# Altium schematic sheet Motors&Drivers.SchDoc
size A3
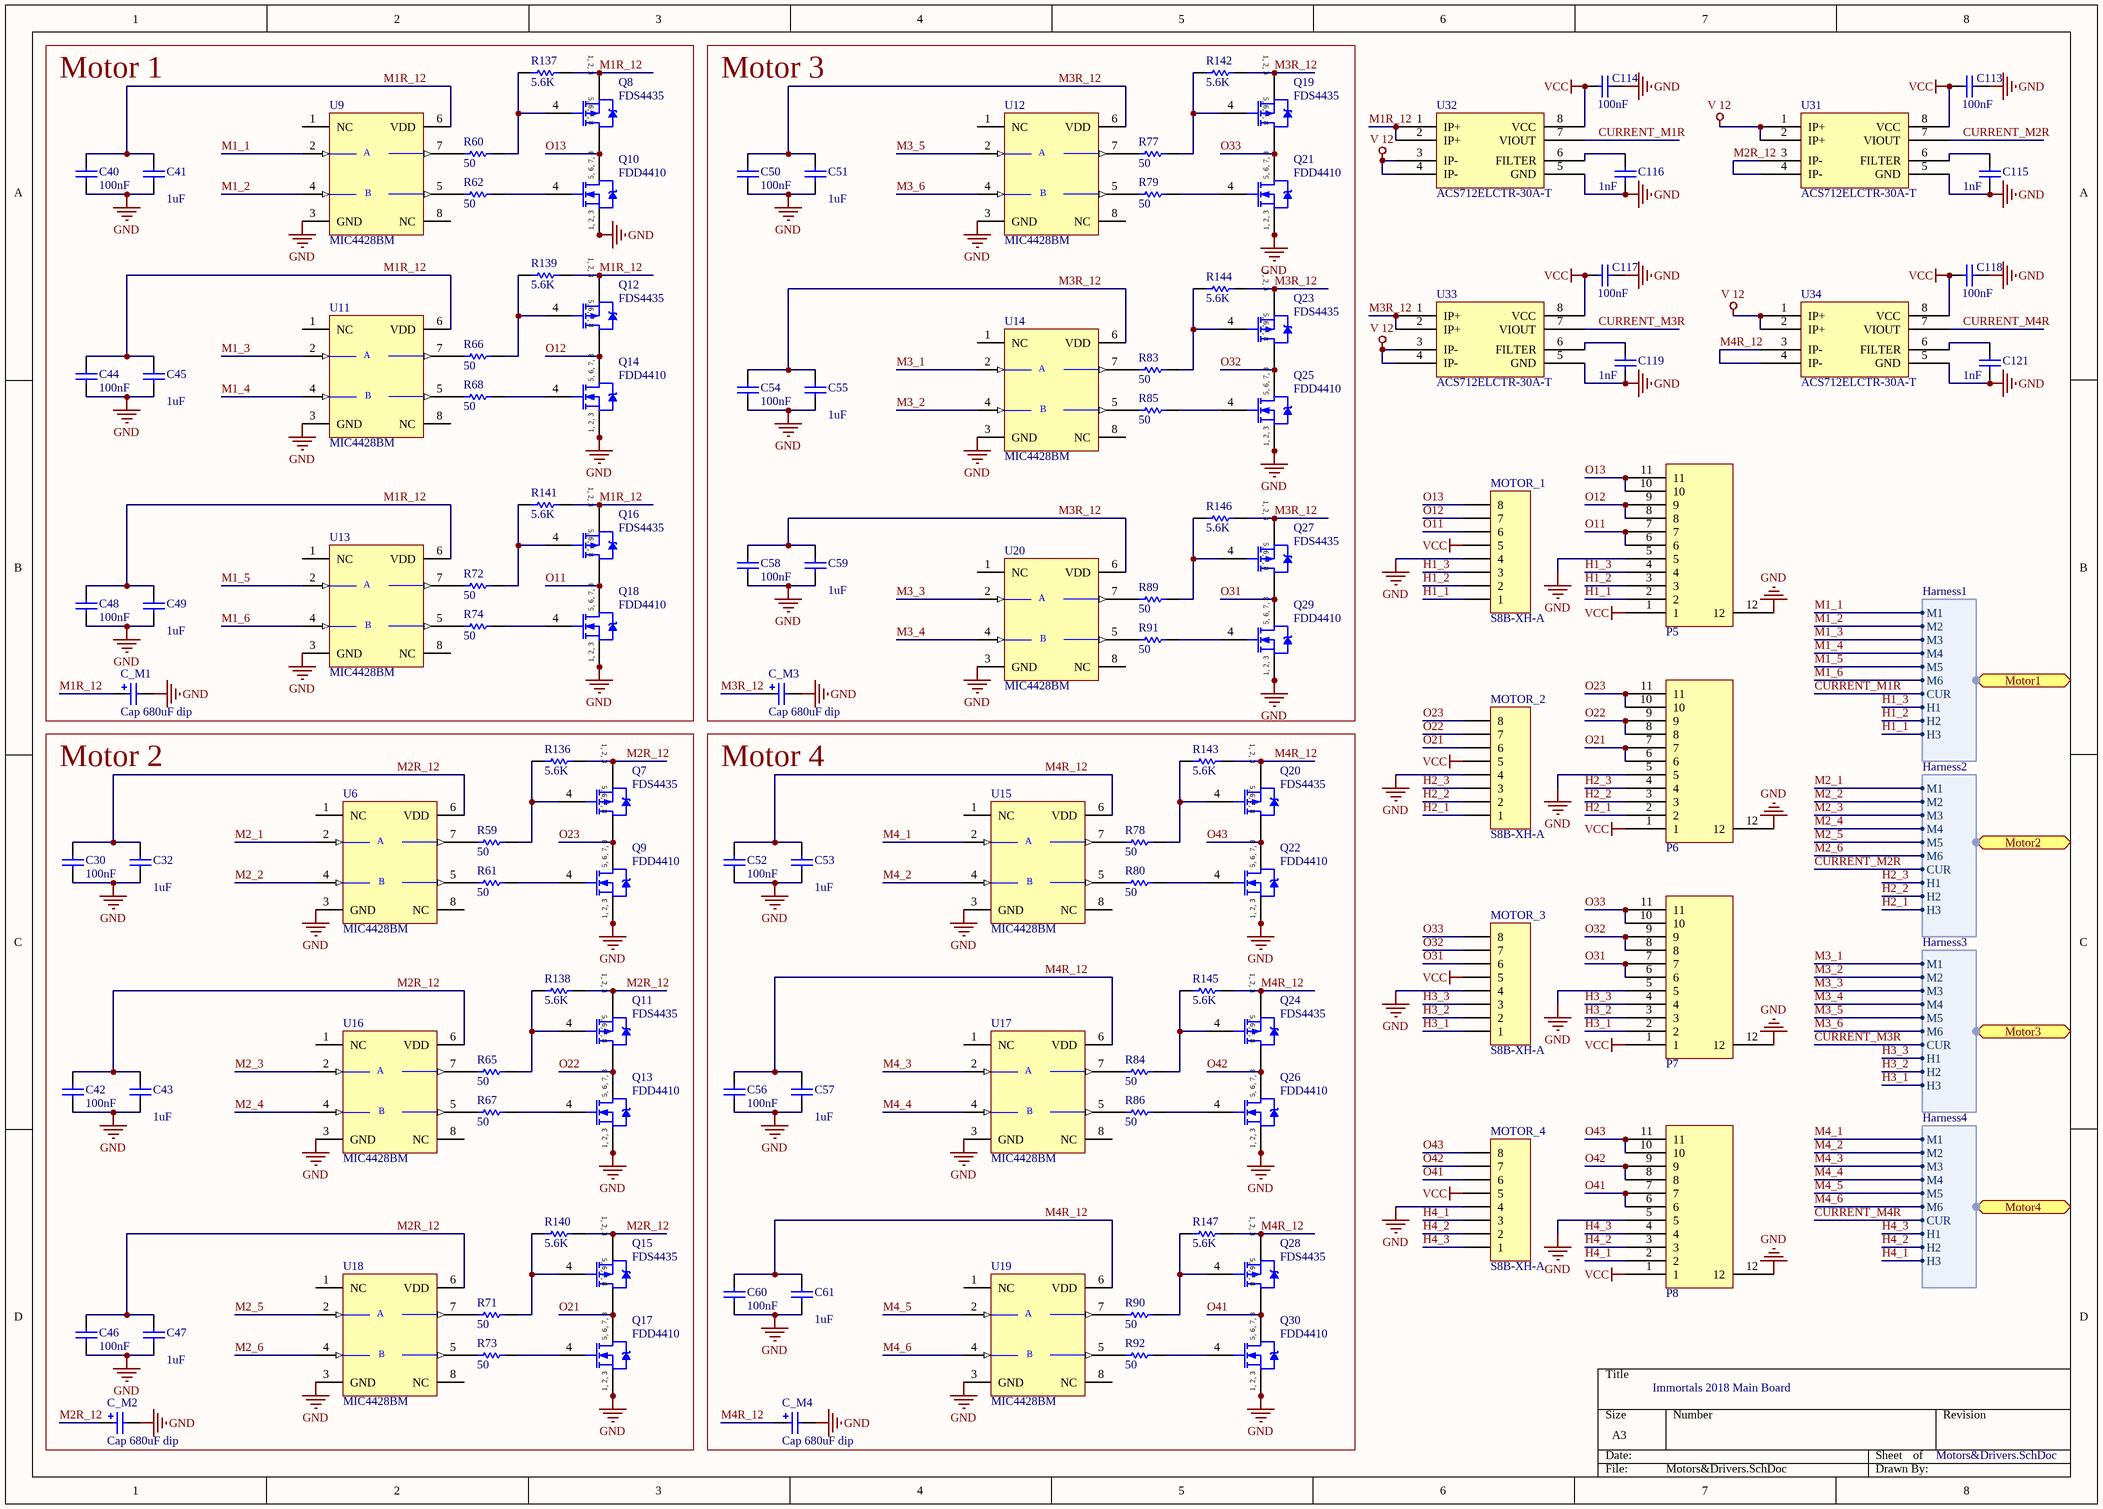
[diagram p0: Motors&Drivers.SchDoc]

## Parts
C30  value 100nF  [1608[0603]]  (hidden comment: Cap 100nF 0603)
C32  value 1uF  [1608[0603]]  (hidden comment: Cap 1uF 0603)
C40  value 100nF  [1608[0603]]  (hidden comment: Cap 100nF 0603)
C41  value 1uF  [1608[0603]]  (hidden comment: Cap 1uF 0603)
C42  value 100nF  [1608[0603]]  (hidden comment: Cap 100nF 0603)
C43  value 1uF  [1608[0603]]  (hidden comment: Cap 1uF 0603)
C44  value 100nF  [1608[0603]]  (hidden comment: Cap 100nF 0603)
C45  value 1uF  [1608[0603]]  (hidden comment: Cap 1uF 0603)
C46  value 100nF  [1608[0603]]  (hidden comment: Cap 100nF 0603)
C47  value 1uF  [1608[0603]]  (hidden comment: Cap 1uF 0603)
C48  value 100nF  [1608[0603]]  (hidden comment: Cap 100nF 0603)
C49  value 1uF  [1608[0603]]  (hidden comment: Cap 1uF 0603)
C50  value 100nF  [1608[0603]]  (hidden comment: Cap 100nF 0603)
C51  value 1uF  [1608[0603]]  (hidden comment: Cap 1uF 0603)
C52  value 100nF  [1608[0603]]  (hidden comment: Cap 100nF 0603)
C53  value 1uF  [1608[0603]]  (hidden comment: Cap 1uF 0603)
C54  value 100nF  [1608[0603]]  (hidden comment: Cap 100nF 0603)
C55  value 1uF  [1608[0603]]  (hidden comment: Cap 1uF 0603)
C56  value 100nF  [1608[0603]]  (hidden comment: Cap 100nF 0603)
C57  value 1uF  [1608[0603]]  (hidden comment: Cap 1uF 0603)
C58  value 100nF  [1608[0603]]  (hidden comment: Cap 100nF 0603)
C59  value 1uF  [1608[0603]]  (hidden comment: Cap 1uF 0603)
C60  value 100nF  [1608[0603]]  (hidden comment: Cap 100nF 0603)
C61  value 1uF  [1608[0603]]  (hidden comment: Cap 1uF 0603)
C113  value 100nF  [1608[0603]]  (hidden comment: Cap 100nF 0603)
C114  value 100nF  [1608[0603]]  (hidden comment: Cap 100nF 0603)
C115  value 1nF  [1608[0603]]  (hidden comment: Cap 1nF 0603)
C116  value 1nF  [1608[0603]]  (hidden comment: Cap 1nF 0603)
C117  value 100nF  [1608[0603]]  (hidden comment: Cap 100nF 0603)
C118  value 100nF  [1608[0603]]  (hidden comment: Cap 100nF 0603)
C119  value 1nF  [1608[0603]]  (hidden comment: Cap 1nF 0603)
C121  value 1nF  [1608[0603]]  (hidden comment: Cap 1nF 0603)
C_M1  Cap 680uF dip  [CAPPR5-5x5]
C_M2  Cap 680uF dip  [CAPPR5-5x5]
C_M3  Cap 680uF dip  [CAPPR5-5x5]
C_M4  Cap 680uF dip  [CAPPR5-5x5]
MOTOR_1  S8B-XH-A  [S8B-XH-A-1]
MOTOR_2  S8B-XH-A  [S8B-XH-A-1]
MOTOR_3  S8B-XH-A  [S8B-XH-A-1]
MOTOR_4  S8B-XH-A  [S8B-XH-A-1]
P5  TYCO  [TYCO]  (value not drawn)
P6  TYCO  [TYCO]  (value not drawn)
P7  TYCO  [TYCO]  (value not drawn)
P8  TYCO  [TYCO]  (value not drawn)
Q7  FDS4435  [SO-8_L]
Q8  FDS4435  [SO-8_L]
Q9  FDD4410  [SO-8_L]
Q10  FDD4410  [SO-8_L]
Q11  FDS4435  [SO-8_L]
Q12  FDS4435  [SO-8_L]
Q13  FDD4410  [SO-8_L]
Q14  FDD4410  [SO-8_L]
Q15  FDS4435  [SO-8_L]
Q16  FDS4435  [SO-8_L]
Q17  FDD4410  [SO-8_L]
Q18  FDD4410  [SO-8_L]
Q19  FDS4435  [SO-8_L]
Q20  FDS4435  [SO-8_L]
Q21  FDD4410  [SO-8_L]
Q22  FDD4410  [SO-8_L]
Q23  FDS4435  [SO-8_L]
Q24  FDS4435  [SO-8_L]
Q25  FDD4410  [SO-8_L]
Q26  FDD4410  [SO-8_L]
Q27  FDS4435  [SO-8_L]
Q28  FDS4435  [SO-8_L]
Q29  FDD4410  [SO-8_L]
Q30  FDD4410  [SO-8_L]
R59  value 50  [1608[0603]]  (hidden comment: Res 50 0603)
R60  value 50  [1608[0603]]  (hidden comment: Res 50 0603)
R61  value 50  [1608[0603]]  (hidden comment: Res 50 0603)
R62  value 50  [1608[0603]]  (hidden comment: Res 50 0603)
R65  value 50  [1608[0603]]  (hidden comment: Res 50 0603)
R66  value 50  [1608[0603]]  (hidden comment: Res 50 0603)
R67  value 50  [1608[0603]]  (hidden comment: Res 50 0603)
R68  value 50  [1608[0603]]  (hidden comment: Res 50 0603)
R71  value 50  [1608[0603]]  (hidden comment: Res 50 0603)
R72  value 50  [1608[0603]]  (hidden comment: Res 50 0603)
R73  value 50  [1608[0603]]  (hidden comment: Res 50 0603)
R74  value 50  [1608[0603]]  (hidden comment: Res 50 0603)
R77  value 50  [1608[0603]]  (hidden comment: Res 50 0603)
R78  value 50  [1608[0603]]  (hidden comment: Res 50 0603)
R79  value 50  [1608[0603]]  (hidden comment: Res 50 0603)
R80  value 50  [1608[0603]]  (hidden comment: Res 50 0603)
R83  value 50  [1608[0603]]  (hidden comment: Res 50 0603)
R84  value 50  [1608[0603]]  (hidden comment: Res 50 0603)
R85  value 50  [1608[0603]]  (hidden comment: Res 50 0603)
R86  value 50  [1608[0603]]  (hidden comment: Res 50 0603)
R89  value 50  [1608[0603]]  (hidden comment: Res 50 0603)
R90  value 50  [1608[0603]]  (hidden comment: Res 50 0603)
R91  value 50  [1608[0603]]  (hidden comment: Res 50 0603)
R92  value 50  [1608[0603]]  (hidden comment: Res 50 0603)
R136  value 5.6K  [1608[0603]]  (hidden comment: Res 5.6K 0603)
R137  value 5.6K  [1608[0603]]  (hidden comment: Res 5.6K 0603)
R138  value 5.6K  [1608[0603]]  (hidden comment: Res 5.6K 0603)
R139  value 5.6K  [1608[0603]]  (hidden comment: Res 5.6K 0603)
R140  value 5.6K  [1608[0603]]  (hidden comment: Res 5.6K 0603)
R141  value 5.6K  [1608[0603]]  (hidden comment: Res 5.6K 0603)
R142  value 5.6K  [1608[0603]]  (hidden comment: Res 5.6K 0603)
R143  value 5.6K  [1608[0603]]  (hidden comment: Res 5.6K 0603)
R144  value 5.6K  [1608[0603]]  (hidden comment: Res 5.6K 0603)
R145  value 5.6K  [1608[0603]]  (hidden comment: Res 5.6K 0603)
R146  value 5.6K  [1608[0603]]  (hidden comment: Res 5.6K 0603)
R147  value 5.6K  [1608[0603]]  (hidden comment: Res 5.6K 0603)
U6  MIC4428BM  [NSO8_L]
U9  MIC4428BM  [NSO8_L]
U11  MIC4428BM  [NSO8_L]
U12  MIC4428BM  [NSO8_L]
U13  MIC4428BM  [NSO8_L]
U14  MIC4428BM  [NSO8_L]
U15  MIC4428BM  [NSO8_L]
U16  MIC4428BM  [NSO8_L]
U17  MIC4428BM  [NSO8_L]
U18  MIC4428BM  [NSO8_L]
U19  MIC4428BM  [NSO8_L]
U20  MIC4428BM  [NSO8_L]
U31  ACS712ELCTR-30A-T  [SOIC_8]
U32  ACS712ELCTR-30A-T  [SOIC_8]
U33  ACS712ELCTR-30A-T  [SOIC_8]
U34  ACS712ELCTR-30A-T  [SOIC_8]

## Blocks framed on the sheet
Motor 1: C40 C41 C44 C45 C48 C49 C_M1 Q8 Q10 Q12 Q14 Q16 Q18 R60 R62 R66 R68 R72 R74 R137 R139 R141 U9 U11 U13
Motor 3: C50 C51 C54 C55 C58 C59 C_M3 Q19 Q21 Q23 Q25 Q27 Q29 R77 R79 R83 R85 R89 R91 R142 R144 R146 U12 U14 U20
Motor 2: C30 C32 C42 C43 C46 C47 C_M2 Q7 Q9 Q11 Q13 Q15 Q17 R59 R61 R65 R67 R71 R73 R136 R138 R140 U6 U16 U18
Motor 4: C52 C53 C56 C57 C60 C61 C_M4 Q20 Q22 Q24 Q26 Q28 Q30 R78 R80 R84 R86 R90 R92 R143 R145 R147 U15 U17 U19

## Ports
Motor1 (harness Harness1), Motor2 (harness Harness2), Motor3 (harness Harness3), Motor4 (harness Harness4)

## Harnesses
Harness1: M1, M2, M3, M4, M5, M6, CUR, H1, H2, H3
Harness2: M1, M2, M3, M4, M5, M6, CUR, H1, H2, H3
Harness3: M1, M2, M3, M4, M5, M6, CUR, H1, H2, H3
Harness4: M1, M2, M3, M4, M5, M6, CUR, H1, H2, H3

## Nets
GND: C30.1 C32.1 C40.1 C41.1 C42.1 C43.1 C44.1 C45.1 C46.1 C47.1 C48.1 C49.1 C50.1 C51.1 C52.1 C53.1 C54.1 C55.1 C56.1 C57.1 C58.1 C59.1 C60.1 C61.1 C113.2 C114.2 C115.2 C116.2 C117.2 C118.2 C119.2 C121.2 C_M1.2 C_M2.2 C_M3.2 C_M4.2 MOTOR_1.4 MOTOR_2.4 MOTOR_3.4 MOTOR_4.4 P5.5 P5.12 P6.5 P6.12 P7.5 P7.12 P8.5 P8.12 Q9.1(S) Q9.2(S) Q9.3(S) Q10.1(S) Q10.2(S) Q10.3(S) Q13.1(S) Q13.2(S) Q13.3(S) Q14.1(S) Q14.2(S) Q14.3(S) Q17.1(S) Q17.2(S) Q17.3(S) Q18.1(S) Q18.2(S) Q18.3(S) Q21.1(S) Q21.2(S) Q21.3(S) Q22.1(S) Q22.2(S) Q22.3(S) Q25.1(S) Q25.2(S) Q25.3(S) Q26.1(S) Q26.2(S) Q26.3(S) Q29.1(S) Q29.2(S) Q29.3(S) Q30.1(S) Q30.2(S) Q30.3(S) U6.3(GND) U9.3(GND) U11.3(GND) U12.3(GND) U13.3(GND) U14.3(GND) U15.3(GND) U16.3(GND) U17.3(GND) U18.3(GND) U19.3(GND) U20.3(GND) U31.5(GND) U32.5(GND) U33.5(GND) U34.5(GND)
V 12: U31.1(IP+) U31.2(IP+) U32.3(IP-) U32.4(IP-) U33.3(IP-) U33.4(IP-) U34.1(IP+) U34.2(IP+)
VCC: C113.1 C114.1 C117.1 C118.1 MOTOR_1.5 MOTOR_2.5 MOTOR_3.5 MOTOR_4.5 P5.1 P6.1 P7.1 P8.1 U31.8(VCC) U32.8(VCC) U33.8(VCC) U34.8(VCC)
CURRENT_M1R: U32.7(VIOUT) ; port Motor1.CUR
CURRENT_M2R: U31.7(VIOUT) ; port Motor2.CUR
CURRENT_M3R: U33.7(VIOUT) ; port Motor3.CUR
CURRENT_M4R: U34.7(VIOUT) ; port Motor4.CUR
H1_1: MOTOR_1.1 P5.2 ; port Motor1.H3
H1_2: MOTOR_1.2 P5.3 ; port Motor1.H2
H1_3: MOTOR_1.3 P5.4 ; port Motor1.H1
H2_1: MOTOR_2.1 P6.2 ; port Motor2.H3
H2_2: MOTOR_2.2 P6.3 ; port Motor2.H2
H2_3: MOTOR_2.3 P6.4 ; port Motor2.H1
H3_1: MOTOR_3.1 P7.2 ; port Motor3.H3
H3_2: MOTOR_3.2 P7.3 ; port Motor3.H2
H3_3: MOTOR_3.3 P7.4 ; port Motor3.H1
H4_1: MOTOR_4.3 P8.2 ; port Motor4.H3
H4_2: MOTOR_4.2 P8.3 ; port Motor4.H2
H4_3: MOTOR_4.1 P8.4 ; port Motor4.H1
M1_1: U9.2(INA) ; port Motor1.M1
M1_2: U9.4(INB) ; port Motor1.M2
M1_3: U11.2(INA) ; port Motor1.M3
M1_4: U11.4(INB) ; port Motor1.M4
M1_5: U13.2(INA) ; port Motor1.M5
M1_6: U13.4(INB) ; port Motor1.M6
M1R_12: C40.2 C41.2 C44.2 C45.2 C48.2 C49.2 C_M1.1 Q8.1(S) Q8.2(S) Q8.3(S) Q12.1(S) Q12.2(S) Q12.3(S) Q16.1(S) Q16.2(S) Q16.3(S) R137.1 R139.1 R141.1 U9.6(VDD) U11.6(VDD) U13.6(VDD) U32.1(IP+) U32.2(IP+)
M2_1: U6.2(INA) ; port Motor2.M1
M2_2: U6.4(INB) ; port Motor2.M2
M2_3: U16.2(INA) ; port Motor2.M3
M2_4: U16.4(INB) ; port Motor2.M4
M2_5: U18.2(INA) ; port Motor2.M5
M2_6: U18.4(INB) ; port Motor2.M6
M2R_12: C30.2 C32.2 C42.2 C43.2 C46.2 C47.2 C_M2.1 Q7.1(S) Q7.2(S) Q7.3(S) Q11.1(S) Q11.2(S) Q11.3(S) Q15.1(S) Q15.2(S) Q15.3(S) R136.1 R138.1 R140.1 U6.6(VDD) U16.6(VDD) U18.6(VDD) U31.3(IP-) U31.4(IP-)
M3_1: U14.2(INA) ; port Motor3.M1
M3_2: U14.4(INB) ; port Motor3.M2
M3_3: U20.2(INA) ; port Motor3.M3
M3_4: U20.4(INB) ; port Motor3.M4
M3_5: U12.2(INA) ; port Motor3.M5
M3_6: U12.4(INB) ; port Motor3.M6
M3R_12: C50.2 C51.2 C54.2 C55.2 C58.2 C59.2 C_M3.1 Q19.1(S) Q19.2(S) Q19.3(S) Q23.1(S) Q23.2(S) Q23.3(S) Q27.1(S) Q27.2(S) Q27.3(S) R142.1 R144.1 R146.1 U12.6(VDD) U14.6(VDD) U20.6(VDD) U33.1(IP+) U33.2(IP+)
M4_1: U15.2(INA) ; port Motor4.M1
M4_2: U15.4(INB) ; port Motor4.M2
M4_3: U17.2(INA) ; port Motor4.M3
M4_4: U17.4(INB) ; port Motor4.M4
M4_5: U19.2(INA) ; port Motor4.M5
M4_6: U19.4(INB) ; port Motor4.M6
M4R_12: C52.2 C53.2 C56.2 C57.2 C60.2 C61.2 C_M4.1 Q20.1(S) Q20.2(S) Q20.3(S) Q24.1(S) Q24.2(S) Q24.3(S) Q28.1(S) Q28.2(S) Q28.3(S) R143.1 R145.1 R147.1 U15.6(VDD) U17.6(VDD) U19.6(VDD) U34.3(IP-) U34.4(IP-)
O11: MOTOR_1.6 P5.6 P5.7 Q16.5(D) Q16.6(D) Q16.7(D) Q16.8(D) Q18.5(D) Q18.6(D) Q18.7(D) Q18.8(D)
O12: MOTOR_1.7 P5.8 P5.9 Q12.5(D) Q12.6(D) Q12.7(D) Q12.8(D) Q14.5(D) Q14.6(D) Q14.7(D) Q14.8(D)
O13: MOTOR_1.8 P5.10 P5.11 Q8.5(D) Q8.6(D) Q8.7(D) Q8.8(D) Q10.5(D) Q10.6(D) Q10.7(D) Q10.8(D)
O21: MOTOR_2.6 P6.6 P6.7 Q15.5(D) Q15.6(D) Q15.7(D) Q15.8(D) Q17.5(D) Q17.6(D) Q17.7(D) Q17.8(D)
O22: MOTOR_2.7 P6.8 P6.9 Q11.5(D) Q11.6(D) Q11.7(D) Q11.8(D) Q13.5(D) Q13.6(D) Q13.7(D) Q13.8(D)
O23: MOTOR_2.8 P6.10 P6.11 Q7.5(D) Q7.6(D) Q7.7(D) Q7.8(D) Q9.5(D) Q9.6(D) Q9.7(D) Q9.8(D)
O31: MOTOR_3.6 P7.6 P7.7 Q27.5(D) Q27.6(D) Q27.7(D) Q27.8(D) Q29.5(D) Q29.6(D) Q29.7(D) Q29.8(D)
O32: MOTOR_3.7 P7.8 P7.9 Q23.5(D) Q23.6(D) Q23.7(D) Q23.8(D) Q25.5(D) Q25.6(D) Q25.7(D) Q25.8(D)
O33: MOTOR_3.8 P7.10 P7.11 Q19.5(D) Q19.6(D) Q19.7(D) Q19.8(D) Q21.5(D) Q21.6(D) Q21.7(D) Q21.8(D)
O41: MOTOR_4.6 P8.6 P8.7 Q28.5(D) Q28.6(D) Q28.7(D) Q28.8(D) Q30.5(D) Q30.6(D) Q30.7(D) Q30.8(D)
O42: MOTOR_4.7 P8.8 P8.9 Q24.5(D) Q24.6(D) Q24.7(D) Q24.8(D) Q26.5(D) Q26.6(D) Q26.7(D) Q26.8(D)
O43: MOTOR_4.8 P8.10 P8.11 Q20.5(D) Q20.6(D) Q20.7(D) Q20.8(D) Q22.5(D) Q22.6(D) Q22.7(D) Q22.8(D)
NetC115_1: C115.1 U31.6(FILTER)
NetC116_1: C116.1 U32.6(FILTER)
NetC119_1: C119.1 U33.6(FILTER)
NetC121_1: C121.1 U34.6(FILTER)
NetQ7_4: Q7.4(G) R59.2 R136.2
NetQ8_4: Q8.4(G) R60.2 R137.2
NetQ9_4: Q9.4(G) R61.2
NetQ10_4: Q10.4(G) R62.2
NetQ11_4: Q11.4(G) R65.2 R138.2
NetQ12_4: Q12.4(G) R66.2 R139.2
NetQ13_4: Q13.4(G) R67.2
NetQ14_4: Q14.4(G) R68.2
NetQ15_4: Q15.4(G) R71.2 R140.2
NetQ16_4: Q16.4(G) R72.2 R141.2
NetQ17_4: Q17.4(G) R73.2
NetQ18_4: Q18.4(G) R74.2
NetQ19_4: Q19.4(G) R77.2 R142.2
NetQ20_4: Q20.4(G) R78.2 R143.2
NetQ21_4: Q21.4(G) R79.2
NetQ22_4: Q22.4(G) R80.2
NetQ23_4: Q23.4(G) R83.2 R144.2
NetQ24_4: Q24.4(G) R84.2 R145.2
NetQ25_4: Q25.4(G) R85.2
NetQ26_4: Q26.4(G) R86.2
NetQ27_4: Q27.4(G) R89.2 R146.2
NetQ28_4: Q28.4(G) R90.2 R147.2
NetQ29_4: Q29.4(G) R91.2
NetQ30_4: Q30.4(G) R92.2
NetR59_1: R59.1 U6.7(OUTA)
NetR60_1: R60.1 U9.7(OUTA)
NetR61_1: R61.1 U6.5(OUTB)
NetR62_1: R62.1 U9.5(OUTB)
NetR65_1: R65.1 U16.7(OUTA)
NetR66_1: R66.1 U11.7(OUTA)
NetR67_1: R67.1 U16.5(OUTB)
NetR68_1: R68.1 U11.5(OUTB)
NetR71_1: R71.1 U18.7(OUTA)
NetR72_1: R72.1 U13.7(OUTA)
NetR73_1: R73.1 U18.5(OUTB)
NetR74_1: R74.1 U13.5(OUTB)
NetR77_1: R77.1 U12.7(OUTA)
NetR78_1: R78.1 U15.7(OUTA)
NetR79_1: R79.1 U12.5(OUTB)
NetR80_1: R80.1 U15.5(OUTB)
NetR83_1: R83.1 U14.7(OUTA)
NetR84_1: R84.1 U17.7(OUTA)
NetR85_1: R85.1 U14.5(OUTB)
NetR86_1: R86.1 U17.5(OUTB)
NetR89_1: R89.1 U20.7(OUTA)
NetR90_1: R90.1 U19.7(OUTA)
NetR91_1: R91.1 U20.5(OUTB)
NetR92_1: R92.1 U19.5(OUTB)

Not connected (* = marked no-connect by the designer): U6 1(NC) 8(NC); U9 1(NC) 8(NC); U11 1(NC) 8(NC); U12 1(NC) 8(NC); U13 1(NC) 8(NC); U14 1(NC) 8(NC); U15 1(NC) 8(NC); U16 1(NC) 8(NC); U17 1(NC) 8(NC); U18 1(NC) 8(NC); U19 1(NC) 8(NC); U20 1(NC) 8(NC)

## Notes on the sheet
- Immortals 2018 Main Board
- (in symbol IRF7201) 5, 6, 7, 8; 1, 2, 3
- (in symbol IRF7204) 1, 2, 3; 5, 6, 7, 8
- (in symbol MAX4427CSA) A; B

## Library data of the parts
C30 C32 C40-C61 C113-C119 C121 = Cap Semi: Capacitor (Semiconductor SIM Model); Published: 8-Jun-2000; LatestRevisionDate: 17-Jul-2002; LatestRevisionNote: Re-released for DXP Platform.; PackageReference: C1206; Publisher: Altium Limited
C_M1-C_M4 = Cap Pol1: Polarized Capacitor (Radial); Published: 8-Jun-2000; LatestRevisionDate: 17-Jul-2002; LatestRevisionNote: Re-released for DXP Platform.; PackageReference: RB7.6-15; Publisher: Altium Limited; Value: 680uF
MOTOR_1-MOTOR_4 = 8pin XH: Value: S8B-XH-A
P5-P8 = TYCO: 11-pin Bottom Contact 30W Motor connector; Value: Bottom Contact
Q7 Q8 Q11 Q12 Q15 Q16 Q19 Q20 Q23 Q24 Q27 Q28 = IRF7204: HEXFET Power MOSFET; Published: 8-Jun-2000; LatestRevisionDate: 13-Apr-2006; LatestRevisionNote: IPC-7351 Footprint Added.; DatasheetVersion: Aug-1997; PackageVersion: Feb-2001; PackageReference: SO-8; Publisher: Altium Limited; PackageDescription: 8-Pin Plastic Small Outline Integrated Circuit 1.27 mm Pitch; Code_JEDEC: MS-012-AA; Code_IPC: SOIC127P600-8; ComponentLink1Description: Manufacturer Link; ComponentLink1URL: http://www.irf.com/; ComponentLink2Description: Datasheet; ComponentLink2URL: http://www.irf.com/product-info/datasheets/data/irf7204.pdf
Q9 Q10 Q13 Q14 Q17 Q18 Q21 Q22 Q25 Q26 Q29 Q30 = IRF7201: HEXFET Power MOSFET; Published: 8-Jun-2000; LatestRevisionDate: 13-Apr-2006; LatestRevisionNote: IPC-7351 Footprint Added.; DatasheetVersion: Sep-1998; PackageVersion: Feb-2001; PackageReference: SO-8; Publisher: Altium Limited; PackageDescription: 8-Pin Plastic Small Outline Integrated Circuit 1.27 mm Pitch; Code_JEDEC: MS-012-AA; Code_IPC: SOIC127P600-8; ComponentLink1Description: Manufacturer Link; ComponentLink1URL: http://www.irf.com/; ComponentLink2Description: Datasheet; ComponentLink2URL: http://www.irf.com/product-info/datasheets/data/irf7201.pdf
R59-R62 R65-R68 R71-R74 R77-R80 R83-R86 R89-R92 R136-R147 = Res Semi: Semiconductor Resistor; Published: 8-Jun-2000; LatestRevisionDate: 17-Jul-2002; LatestRevisionNote: Re-released for DXP Platform.; PackageReference: AXIAL-0.5; Publisher: Altium Limited
U6 U9 U11-U20 = MAX4427CSA: Dual High-Speed 1.5A MOSFET Driver; Published: 16-Jan-2001; LatestRevisionDate: 13-Apr-2006; LatestRevisionNote: IPC-7351 Footprint Added.; DatasheetVersion: Mar-1993; PackageReference: NSO8; Publisher: Altium Limited; PackageDescription: 8-Pin Small Outline Integrated Circuit 1.27 mm Pitch; Code_JEDEC: MS-012-AA; Code_IPC: SOIC127P600-8; ComponentLink1Description: Manufacturer Link; ComponentLink1URL: http://www.maxim-ic.com/; ComponentLink2Description: Datasheet; ComponentLink2URL: http://pdfserv.maxim-ic.com/en/ds/MAX4426-MAX4428.pdf